# Altium schematic sheet cando.SchDoc: cando
size A4; DocumentNumber: 1; Revision: 1.0; SheetNumber: 1; SheetTotal: 1; DrawnBy: SU; DocumentSize: A4; PCAName: cando
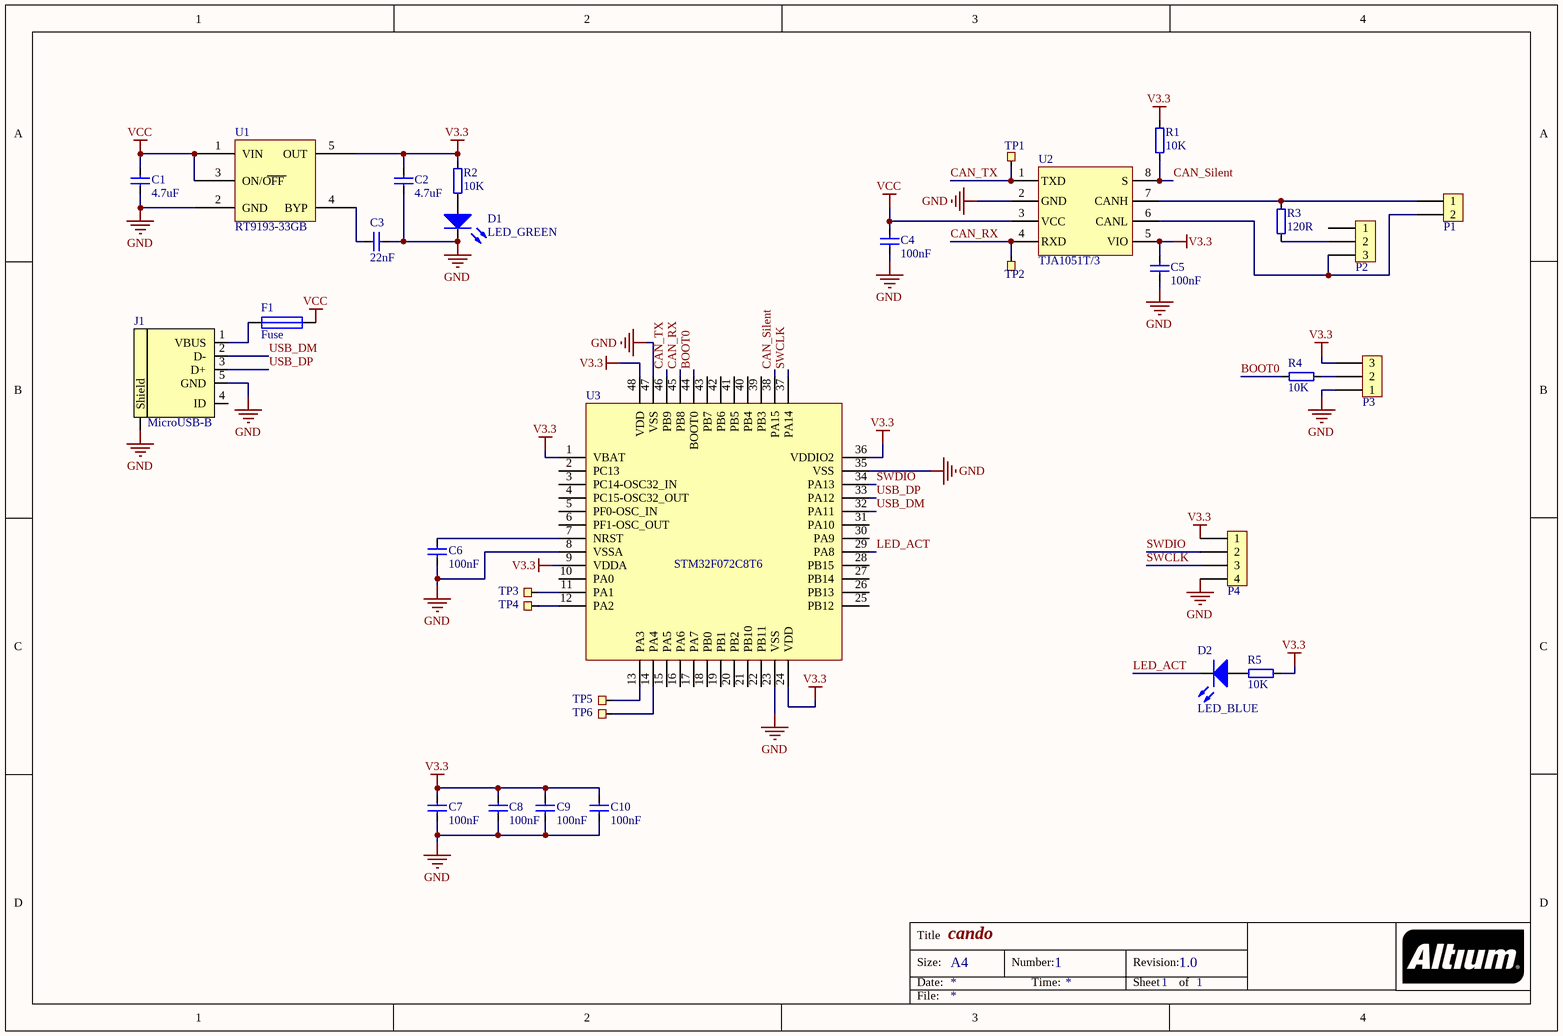
[diagram p0: cando.SchDoc]

## Parts
C1  4.7uF  [0603C]
C2  4.7uF  [0603C]
C3  22nF  [0603C]
C4  100nF  [0603C]
C5  100nF  [0603C]
C6  100nF  [0603C]
C7  100nF  [0603C]
C8  100nF  [0603C]
C9  100nF  [0603C]
C10  100nF  [0603C]
D1  LED_GREEN  [LED_0603_GREEN]
D2  LED_BLUE  [LED_0603_BLUE]
F1  Fuse  [FUSE_0805]
J1  MicroUSB-B  [USB-Micro_0]
P1  MKDSN1.5_2-5.08  [MKDSN-5.08-3P]  (value not drawn)
P2  Header_3_2.54  [HEADER_3]  (value not drawn)
P3  Header_3_2.54  [HEADER_3]  (value not drawn)
P4  PAD_4_2.54  [HEADER_4_PAD]  (value not drawn)
R1  10K  [0603R]
R2  10K  [0603R]
R3  120R  [0603R]
R4  10K  [0603R]
R5  10K  [0603R]
TP1  Ø1.5mm,SMD  [TP_SMD]  (value not drawn)  (no BOM)
TP2  Ø1.5mm,SMD  [TP_SMD]  (value not drawn)  (no BOM)
TP3  Ø1.5mm,SMD  [TP_SMD]  (value not drawn)  (no BOM)
TP4  Ø1.5mm,SMD  [TP_SMD]  (value not drawn)  (no BOM)
TP5  Ø1.5mm,SMD  [TP_SMD]  (value not drawn)  (no BOM)
TP6  Ø1.5mm,SMD  [TP_SMD]  (value not drawn)  (no BOM)
U1  RT9193-33GB  [SOT23-5]
U2  TJA1051T/3  [SOIC8]
U3  STM32F072C8T6  [STM-LQFP48_N]

## Nets
GND: C1.2 C2.2 C3.2 C4.2 C5.2 C6.2 C7.2 C8.2 C9.2 C10.2 D1.2(K) J1.5(GND) J1.6(Shield) P3.1 P4.4 U1.2(GND) U2.2(GND) U3.8(VSSA) U3.23(VSS) U3.35(VSS) U3.47(VSS)
V3.3: C2.1 C5.1 C7.1 C8.1 C9.1 C10.1 P3.3 P4.1 R1.2 R2.1 R5.1 U1.5(OUT) U2.5(VIO) U3.1(VBAT) U3.9(VDDA) U3.24(VDD) U3.36(VDDIO2) U3.48(VDD)
VCC: C1.1 C4.1 F1.2 U1.1(VIN) U1.3(ON/OFF) U2.3(VCC)
BOOT0: R4.1 U3.44(BOOT0)
CAN_RX: TP2.1 U2.4(RXD) U3.45(PB8)
CAN_Silent: R1.1 U2.8(S) U3.38(PA15)
CAN_TX: TP1.1 U2.1(TXD) U3.46(PB9)
LED_ACT: D2.2(K) U3.29(PA8)
SWCLK: P4.3 U3.37(PA14)
SWDIO: P4.2 U3.34(PA13)
USB_DM: J1.2(D-) U3.32(PA11)
USB_DP: J1.3(D+) U3.33(PA12)
NetC3_1: C3.1 U1.4(BYP)
NetC6_1: C6.1 U3.7(NRST)
NetD1_1: D1.1(A) R2.2
NetD2_1: D2.1(A) R5.2
NetF1_1: F1.1 J1.1(VBUS)
NetP1_1: P1.1 R3.1 U2.7(CANH)
NetP1_2: P1.2 P2.3 U2.6(CANL)
NetP2_2: P2.2 R3.2
NetP3_2: P3.2 R4.2
NetTP3_1: TP3.1 U3.11(PA1)
NetTP4_1: TP4.1 U3.12(PA2)
NetTP5_1: TP5.1 U3.13(PA3)
NetTP6_1: TP6.1 U3.14(PA4)

Not connected (* = marked no-connect by the designer): J1 4(ID); P2 1; U3 2(PC13) 3(PC14-OSC32_IN) 4(PC15-OSC32_OUT) 5(PF0-OSC_IN) 6(PF1-OSC_OUT) 10(PA0) 15(PA5) 16(PA6) 17(PA7) 18(PB0) 19(PB1) 20(PB2) 21(PB10) 22(PB11) 25(PB12) 26(PB13) 27(PB14) 28(PB15) 30(PA9) 31(PA10) 39(PB3) 40(PB4) 41(PB5) 42(PB6) 43(PB7)

## Notes on the sheet
- Title
- Size:
- Date:
- A4
- Number:
- Time:
- Revision:
- Sheet
- of
- File:

## Library data of the parts
C1-C10 = CAP: Capacitor
  C1 C2: Value: 4.7uF
  C3: Value: 22nF
  C4-C10: Value: 100nF
D1 D2 = LED
  D1: Value: LED_GREEN
  D2: Value: LED_BLUE
J1 = MiniUSB-AB-SMT: MicroUSB-B-SMT; Value: MicroUSB-B
P1 = Header_2: Header_2_2.54; Value: MKDSN1.5_2-5.08
P2 P3 = Header_3: Value: Header_3_2.54
P4 = Header_4: Header_4_2.54; Value: PAD_4_2.54
R1-R5 = RES: Resistor
  R1 R2 R4 R5: Value: 10K
  R3: Value: 120R
TP1-TP6 = TP_SMD_Ø1.0MM: 1.0mm circular SMD testpad; Value: Ø1.5mm,SMD
U1 = RT9193-33GB: Chip, RT9193-33GB, LDO Regulator; Value: RT9193-33GB
U2 = TJA1051T/3: Chip, TJA1051T/3, CAN chip; Value: TJA1051T/3
U3 = STM32F072C8T6: ARM Cortex-M0 32-bit MCU, 64 KB Flash, 8 KB Internal RAM, 39 I/Os, 48-pin LQFP, -40 to 85 degC, Tray; FLASH Size (Prog) (kB): 64; I/Os (High Current): 39; Internal RAM Size (kB): 8; Operating Frequency(F) (Processor speed) (MHz): 48; Supply Voltage(Vcc) min (V): 2.4; DatasheetVersion: Rev. 1; PackageVersion: Rev. 6, 06/2013; PackageReference: LQFP48; PackageDescription: 48-Pin Low Profile Quad Flat Package, 7 x 7 mm Body, 0.5 mm Pitch; Supplier 1: Digi-Key; Supplier Part Number 1: 497-14043-ND; Supplier 2: Newark; Supplier Part Number 2: 06X3647; Supplier 3: Mouser; Supplier Part Number 3: 511-STM32F030C8T6; Core: ARM Cortex-M0; Packing: Tray; Mounting Technology: Surface Mount; PartNumber: STM32F072C8T6; ComponentLink1Description: Manufacturer URL; ComponentLink1URL: http://www.st.com/web/en/home.html; ComponentLink2Description: Datasheet; ComponentLink2URL: http://www.st.com/st-web-ui/static/active/en/resource/technical/document/datasheet/DM00088500.pdf; ComponentLink3Description: Package Specification; ComponentLink3URL: http://www.st.com/st-web-ui/static/active/en/resource/technical/document/datasheet/DM00058181.pdf